# EAGLE design HV_powerSupply_board_20210802 (EAGLE 9.7.0)
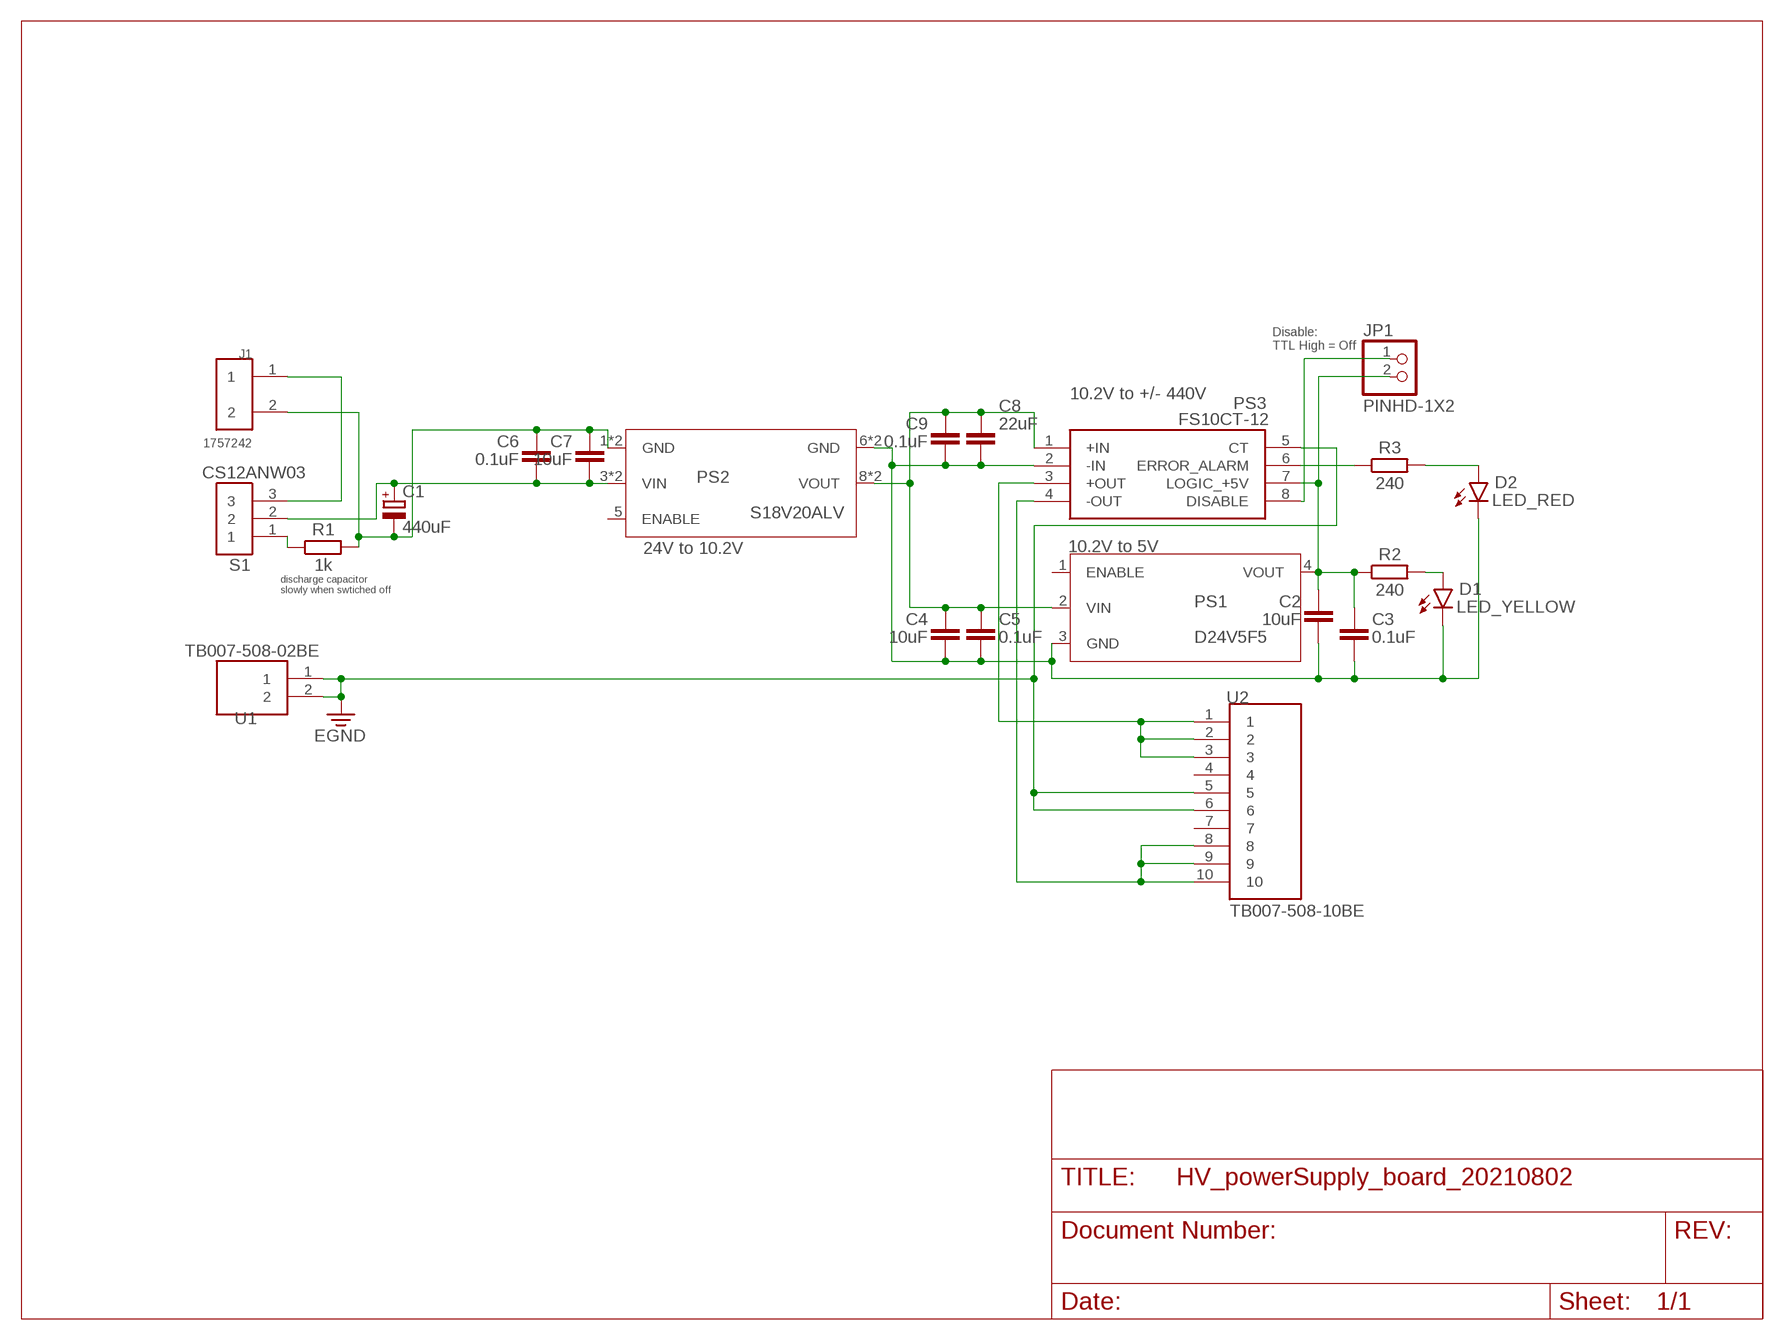
[diagram p0: schematic, sheet 1]

## Parts
C1  440uF  C-POL_RADIAL-11MM-DIA  [CAPPRD508W65D1000H1100B]
C2  10uF  C_CHIP-1210(3225-METRIC)  [CAPC3225X135]
C3  0.1uF  C_CHIP-0603(1608-METRIC)  [CAPC1608X85]
C4  10uF  C_CHIP-1210(3225-METRIC)  [CAPC3225X135]
C5  0.1uF  C_CHIP-0603(1608-METRIC)  [CAPC1608X85]
C6  0.1uF  C_CHIP-0603(1608-METRIC)  [CAPC1608X85]
C7  10uF  C_CHIP-1210(3225-METRIC)  [CAPC3225X135]
C8  22uF  C_CHIP-1210(3225-METRIC)  [CAPC3225X135]
C9  0.1uF  C_CHIP-0603(1608-METRIC)  [CAPC1608X85]
D1  LED_YELLOW  LED_RADIAL_YELLOW  [LEDRD254W60D565H860B_Y]
D2  LED_RED  LED_RADIAL_RED  [LEDRD254W60D565H860B]
J1  1757242  [PHOENIX_1757242]
JP1  PINHD-1X2  [1X02]
PS1  D24V5F5  [D24V5F5]
PS2  S18V20ALV  [S18V20ALV]
PS3  FS10CT-12  [FS10CT12]
R1  1k  R_CHIP-1206(3216-METRIC)  [RESC3216X70]
R2  240  R_CHIP-1206(3216-METRIC)  [RESC3216X70]
R3  240  R_CHIP-1206(3216-METRIC)  [RESC3216X70]
S1  CS12ANW03  [CS12ANW03]
U1  TB007-508-02BE  [CUI_TB007-508-02BE]
U2  TB007-508-10BE  [CUI_TB007-508-10BE]

## Nets
24COM: C2.2 C3.2 C4.2 C5.2 C8.2 C9.2 D1.2(C) D2.2(C) PS1.3(GND) PS2.6(GND) PS2.7(GND) PS3.2(-IN)
24V_COM: C1.2(-) C6.1 C7.1 J1.2 PS2.1(GND) PS2.2(GND) R1.2
+5V: C2.1 C3.1 JP1.2 PS1.4(VOUT) PS3.7(LOGIC_+5V) R2.1
ERROR_ALARM: PS3.6(ERROR_ALARM) R3.1
HV_COM: PS3.5(CT) U1.1 U1.2 U2.5 U2.6 ; supply symbol labelled EGND
N$1: JP1.1 PS3.8(DISABLE)
N$6: R1.1 S1.1
N$11: J1.1 S1.3
N$15: C4.1 C5.1 C8.1 C9.1 PS1.2(VIN) PS2.8(VOUT) PS2.9(VOUT) PS3.1(+IN)
N$17: C1.1(+) C6.2 C7.2 PS2.3(VIN) PS2.4(VIN) S1.2
N$31: D2.1(A) R3.2
N$33: D1.1(A) R2.2
V+ [HV]: PS3.3(+OUT) U2.1 U2.2 U2.3
V- [HV]: PS3.4(-OUT) U2.8 U2.9 U2.10
Unconnected: PS1.1(ENABLE) PS2.5(ENABLE) U2.4 U2.7

## Notes on the sheet
- Disable: 
  TTL High = Off
- 10.2V to +/- 440V
- 24V to 10.2V | 10.2V to 5V
- discharge capacitor 
  slowly when swtiched off

## Library data of the parts
C1 = Capacitor:C-POL: Capacitor Polarised - Generic; CATEGORY: Capacitor
C2-C9 = Capacitor:C: Capacitor - Generic; CATEGORY: Capacitor
D1 D2 = Opto-Electronic:LED_RADIAL: LED - Generic; CATEGORY: Opto-Electronic; SUB-CATEGORY: LED
J1 = Connectors:1757242: Phoenix 1757242 MSTBA 2.5/ 2-G-5.08 Base Strip/Header 4 Kilo-Volt Surge 320 Volt Rated III/2 12 Amp Green Plug-In; DESCRIPTION: 2 Position Terminal Block Header, Male Pins, Shrouded (4 Side) 0.200 (5.08mm) 90°, Right Angle Through Hole; DIGI-KEY_PART_NUMBER: 277-1106-ND; MF: Phoenix Contact; MP: 1757242; PACKAGE: None; PURCHASE-URL: https://pricing.snapeda.com/search/part/1757242/?ref=eda
JP1 = Connector:PINHD-1X2: PIN HEADER; CATEGORY: CONNECTOR; SUB-CATEGORY: PIN-HEADER
PS1 = Polulu:D24V5F5: The compact (0.4″ × 0.5″) D24V5F5 synchronous buck voltage regulator takes an input voltage of 5.1 V up to 36 V and efficiently reduces it to 5 V while allowing for a maximum output current of 500 mA. Polulu Link: https://www.pololu.com/product/2843
PS2 = Polulu:S18V20ALV: Pololu Adjustable 4-12V Step-Up/Step-Down Voltage Regulator S18V20ALV
PS3 = XP Power:FS10CT-12: XP Power FS10CT-12 DC to High Voltage DC Converter 0 12 V dc 10mA 1kV Source: Datasheet <https://www.xppower.com/Portals/0/pdfs/SF_FS_Series.pdf>; DESCRIPTION: XP Power FS10CT-12 DC to High Voltage DC Converter 0 12 V dc 10mA 1kV; HEIGHT: 12.7mm; MANUFACTURER_NAME: XP POWER; MANUFACTURER_PART_NUMBER: FS10CT-12
R1-R3 = Resistor:R: Resistor Fixed - Generic; CATEGORY: Resistor; SUB-CATEGORY: Fixed
S1 = Connectors:CS12ANW03: NKK SWITCHES - CS12ANW03 - SWITCH, SLIDE, SPDT, 3A, 250V, TH Source: Datasheet <http://www.nkkswitches.com/pdf/cs.pdf>; ARROW_PART_NUMBER: CS12ANW03; ARROW_PRICE-STOCK: https://www.arrow.com/en/products/cs12anw03/nkk-switches; DESCRIPTION: NKK SWITCHES - CS12ANW03 - SWITCH, SLIDE, SPDT, 3A, 250V, TH; HEIGHT: mm; MANUFACTURER_NAME: NKK Switches; MANUFACTURER_PART_NUMBER: CS12ANW03; MOUSER_PART_NUMBER: 633-CS12ANW03; MOUSER_PRICE-STOCK: https://www.mouser.co.uk/ProductDetail/NKK-Switches/CS12ANW03?qs=4P1McwaGddbVHu%252BBZT0egw%3D%3D
U1 = Connectors:TB007-508-02BE; CUI_PURCHASE_URL: https://www.cuidevices.com/product/interconnect/connectors/terminal-blocks/tb007-508-series?utm_source=snapeda.com&utm_medium=referral&utm_campaign=snapedaBOM; DESCRIPTION: 2~24 Poles, Screw Type, Horizontal, 5.08 Pitch, 24~12 (AWG), Terminal Block Connector; DIGI-KEY_PART_NUMBER: 102-6203-ND; MF: CUI Devices; MP: TB007-508-02BE; PACKAGE: None
U2 = Connectors:TB007-508-10BE; MANUFACTURER: CUI; STANDARD: Manufacturer Recommendations

## Board
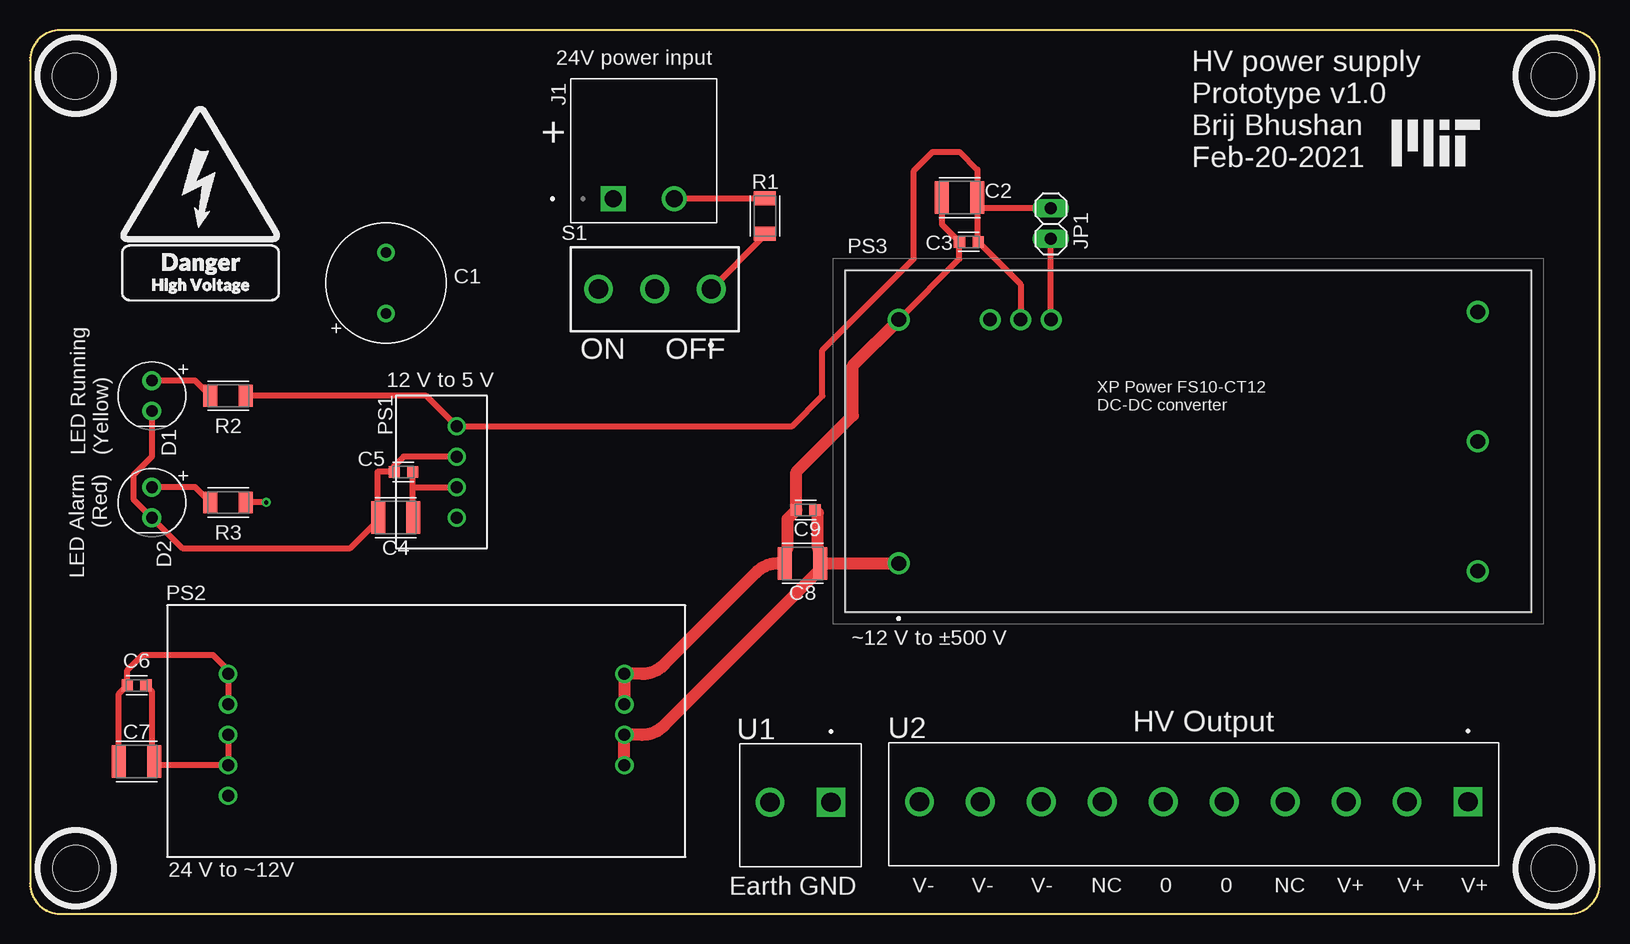
[diagram p1: board, top side]
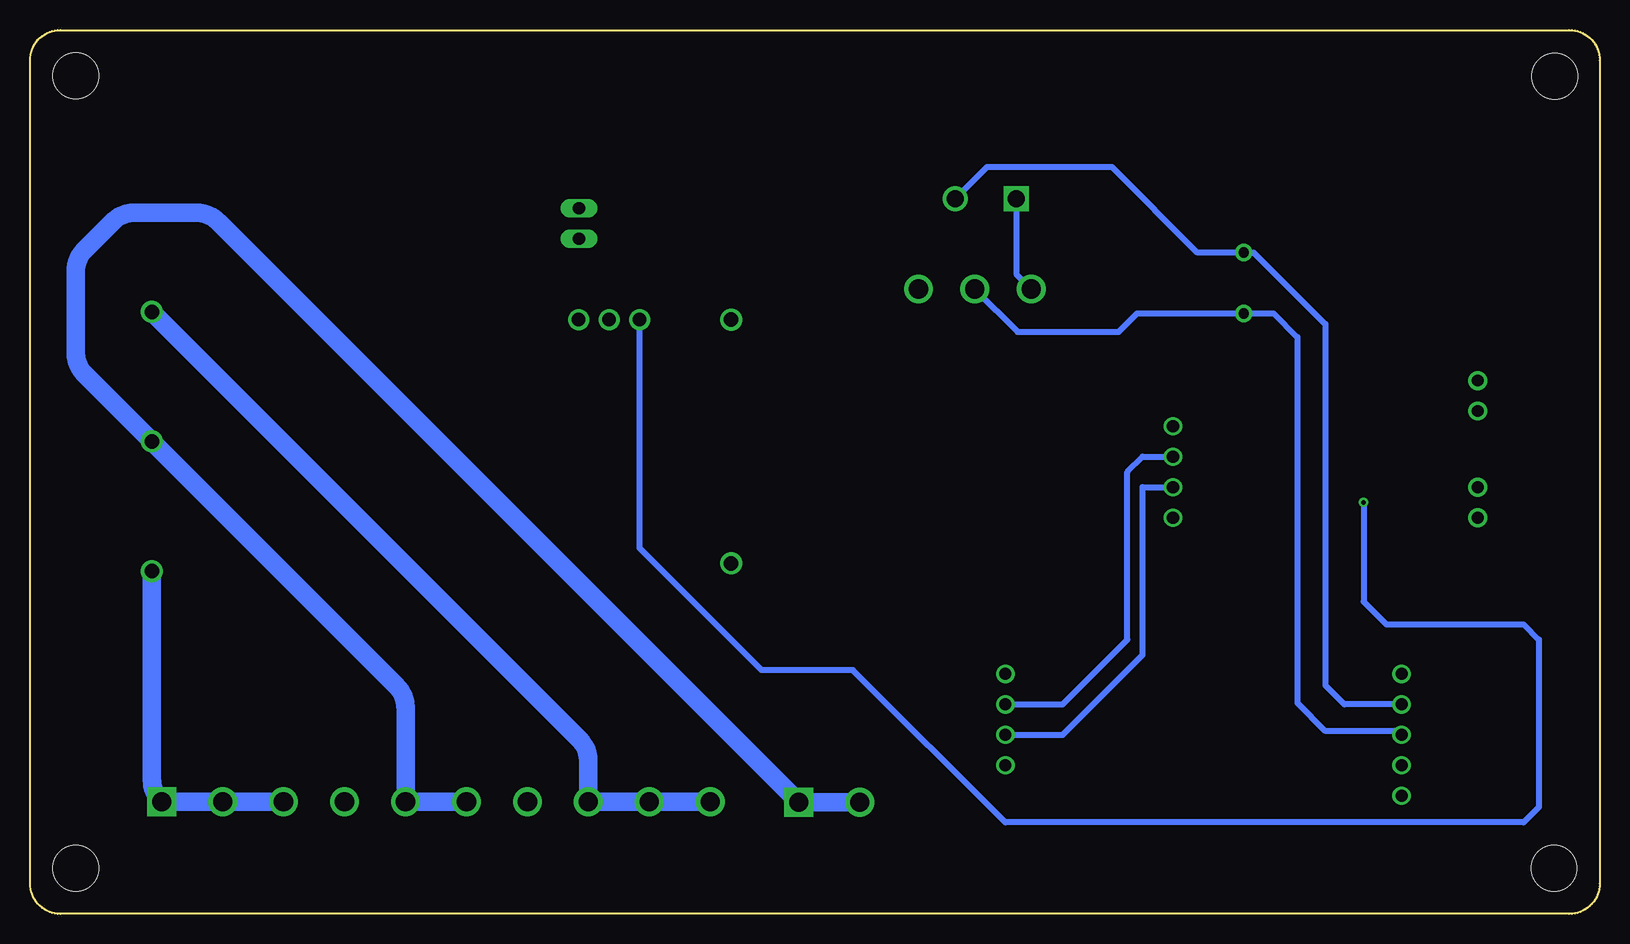
[diagram p2: board, bottom side, seen from below]

Size 130.81 x 73.66 mm. Coordinates in mm from the lower left corner, seen from the top.
Outline: 128.27,73.66 2.54,73.66 arc90 0,71.12 0,2.54 arc90 2.54,0 128.27,0 arc90 130.81,2.54 130.81,71.12 arc90 128.27,73.66
Copper layers (1*16): Top 0.035mm / dielectric 1.5mm / Bottom 0.035mm
Design rules "default *": minimum track width 10mil, minimum drill 0.35mm, track to track 10mil, track to pad 20mil, pad to pad 20mil, via to via 20mil, smd to smd 6mil, copper to edge 40mil, drill to drill 6mil, minimum pad ring 10mil, minimum via ring 8mil, stop-mask expansion 4mil, vias tented up to drill 0mil, thermal gap 10mil
Holes 3.81 mm at 3.76,69.8 127,69.85 3.81,3.81 127,3.81

### Footprints (pad centres in the part's own frame; a part is rotated, then mirrored left to right if it is on the bottom)
CAPPRD508W65D1000H1100B = drill 0.85 pad 1.45: 1 -2.54,0; 2 2.54,0
CAPC3225X135 = smd 1.165 x 2.715: 1 -1.475,0; 2 1.475,0
CAPC1608X85 = smd 0.921 x 0.97: 1 -0.775,0; 2 0.775,0
LEDRD254W60D565H860B_Y = drill 0.981 pad 1.581: 1 -1.27,0; 2 1.27,0
LEDRD254W60D565H860B = drill 0.981 pad 1.581: 1 -1.27,0; 2 1.27,0
PHOENIX_1757242 = drill 1.4 square: 1 -2.54,-4 | drill 1.4: 2 2.54,-4
1X02 = drill 1.016 long: 1 -1.27,0; 2 1.27,0
D24V5F5 = drill 1.016: 1 -3.81,0; 2 -1.27,0; 3 1.27,0; 4 3.81,0
S18V20ALV = drill 1.016: 1 -16.51,4.763; 2 -16.51,2.223; 3 -16.51,-0.318; 4 -16.51,-2.857; 5 -16.51,-5.397; 6 16.51,4.763; 7 16.51,2.223; 8 16.51,-0.318; 9 16.51,-2.857
FS10CT12 = drill 1.22 pad 1.6: 1 0,0; 2 0,20.32; 3 48.26,-0.64; 4 48.26,20.96; 5 48.26,10.16 | drill 1.11 pad 1.75: 6 7.62,20.32; 7 10.16,20.32; 8 12.7,20.32
RESC3216X70 = smd 1.165 x 1.815: 1 -1.475,0; 2 1.475,0
CS12ANW03 = drill 1.6 pad 2.37: 1 0,-4.7; 2 0,0; 3 0,4.7
CUI_TB007-508-02BE = drill 1.6 square: 1 0,0 | drill 1.6: 2 5.08,0
CUI_TB007-508-10BE = drill 1.6 square: 1 0,0 | drill 1.6: 2 5.08,0; 3 10.16,0; 4 15.24,0; 5 20.32,0; 6 25.4,0; 7 30.48,0; 8 35.56,0; 9 40.64,0; 10 45.72,0

### Placement (x,y rotation side)
C1  29.67,52.58 90 top
C2  77.47,59.69 180 top
C3  78.23,56.01 180 top
C4  30.48,33.02 180 top
C5  31.11,36.83 180 top
C6  8.89,19.05 0 top
C7  8.89,12.7 0 top
C8  64.39,29.21 180 top
C9  64.64,33.66 180 top
D1  10.16,43.18 270 top
D2  10.16,34.29 270 top
J1  51.16,63.6 0 top
JP1  85.06,57.53 90 top
PS1  35.56,36.83 90 top
PS2  33.02,15.24 0 top
PS3  72.39,29.21 0 top
R1  61.24,58.17 90 top
R2  16.51,43.18 180 top
R3  16.51,34.29 180 top
S1  52.07,52.07 90 top
U1  66.75,9.3 180 top
U2  119.84,9.35 180 top

### Tracks (layer width: path | path; a pad name or v marks a point on that pad's centre or on a via)
24COM
  Top 0.254: 30.35,37.21 30.35,36.83 C5.2 | 63.12,30.48 63.12,29.34 C8.2
  Top 0.508: D1.2 10.16,38.1 8.61,36.55 8.61,34.57 D2.2 12.7,30.48 26.67,30.48 29,32.81 C4.2 28.96,33.07 28.96,36.83 C5.2 | C2.2 76,57.47 C3.2 77.46,54.6 PS3.2 | 30.35,37.21 30.35,37.32 31.14,38.1 PS1.3
  Top 1.016: 63.12,30.48 63.12,32.91 C9.2 63.87,36.83 68.58,41.54 68.58,45.72 PS3.2 | PS2.7 PS2.6 51.02,20 arc45 52.81,20.75 60.53,28.47 arc-45 62.33,29.21 C8.2
  Bottom 0.508: PS1.3 38.1,38.1 39.37,36.83 39.37,22.86 44.77,17.46 PS2.7
24V_COM
  Top 0.508: C7.1 7.42,18.35 C6.1 8.12,20.32 9.38,21.59 15.24,21.59 16.51,20.32 PS2.1 PS2.2 | J1.2 53.73,59.64 R1.2
  Bottom 0.508: PS2.2 21.27,17.46 22.86,19.05 22.86,49.14 28.83,55.12 C1.2 33.53,55.12 40.64,62.23 51.07,62.23 J1.2
+5V
  Top 0.508: PS3.7 82.55,52.46 C3.1 78.94,56.07 C2.1 | R2.1 33.02,43.18 PS1.4 63.5,40.64 66.04,43.18 66.04,46.99 73.66,54.61 73.66,61.91 75.25,63.5 77.47,63.5 78.94,62.02 C2.1 | JP1.2 78.94,58.8 C2.1
ERROR_ALARM  (via drill 0.35)
  Top 0.508: v19.68,34.29 R3.1
  Bottom 0.508: v19.68,34.29 19.68,26.04 17.78,24.13 6.35,24.13 5.08,22.86 5.08,8.89 6.35,7.62 49.53,7.62 62.23,20.32 69.85,20.32 80.01,30.48 PS3.6
HV_COM
  Bottom 1.524: U2.6 U2.5 99.52,17.18 arc-45 100.26,18.98 PS3.5 126.26,44.98 arc45 127,46.77 127,53.56 arc45 126.26,55.35 123.93,57.68 arc45 122.14,58.42 116.93,58.42 arc45 115.13,57.68 U1.1 U1.2
N$1
  Top 0.508: JP1.1 85.06,49.55 PS3.8
N$6
  Top 0.508: S1.1 61.24,56.54 R1.1
N$11
  Bottom 0.508: J1.1 48.62,53.32 S1.3
N$15
  Top 0.254: 65.66,30.48 65.66,29.34 C8.1 | 31.88,36.83 C5.1 | C4.1 31.88,33.02
  Top 0.508: 65.66,33.41 C9.1 | 31.88,33.02 31.88,35.56 | 31.88,35.56 31.88,36.83 | 31.88,35.56 PS1.2 | 65.86,28.72 C8.1
  Top 1.016: 65.66,30.48 65.66,33.41 | PS2.9 PS2.8 51.02,14.92 arc45 52.81,15.67 65.86,28.72 | C8.1 PS3.1
  Bottom 0.508: PS1.2 38.1,35.56 38.1,21.59 44.77,14.92 PS2.8
N$17
  Top 0.254: 10.16,13.97 10.16,12.83 C7.2
  Top 0.508: C7.2 10.68,12.38 PS2.4 PS2.3 | C6.2 10.16,18.55 10.16,13.97
  Bottom 0.508: PS2.3 16.83,15.24 22.86,15.24 25.2,17.58 25.2,48.06 27.18,50.04 C1.1 38.56,50.04 40.09,48.51 48.51,48.51 S1.2
N$31
  Top 0.508: D2.1 13.77,35.56 R3.2
N$33
  Top 0.508: R2.2 13.77,44.45 D1.1
V+
  Bottom 1.524: U2.3 U2.2 U2.1 119.91,9.42 arc45 120.65,11.21 PS3.3
V-
  Bottom 1.524: U2.10 U2.9 U2.8 84.28,12.74 arc-45 85.02,14.54 119.82,49.33 119.82,49.34 PS3.4

### Text on the board
tNames: 24V power input | + | HV power supply / Prototype v1.0 / Brij Bhushan / Feb-20-2021 | ON ⇔ OFF | 12 V to 5 V | XP Power FS10-CT12 / DC-DC converter | LED Running / (Yellow) | LED Alarm / (Red) | ~12 V to ±500 V | HV Output | 24 V to ~12V | Earth GND | V- | V- | V- | NC | 0 | 0 | NC | V+ | V+ | V+